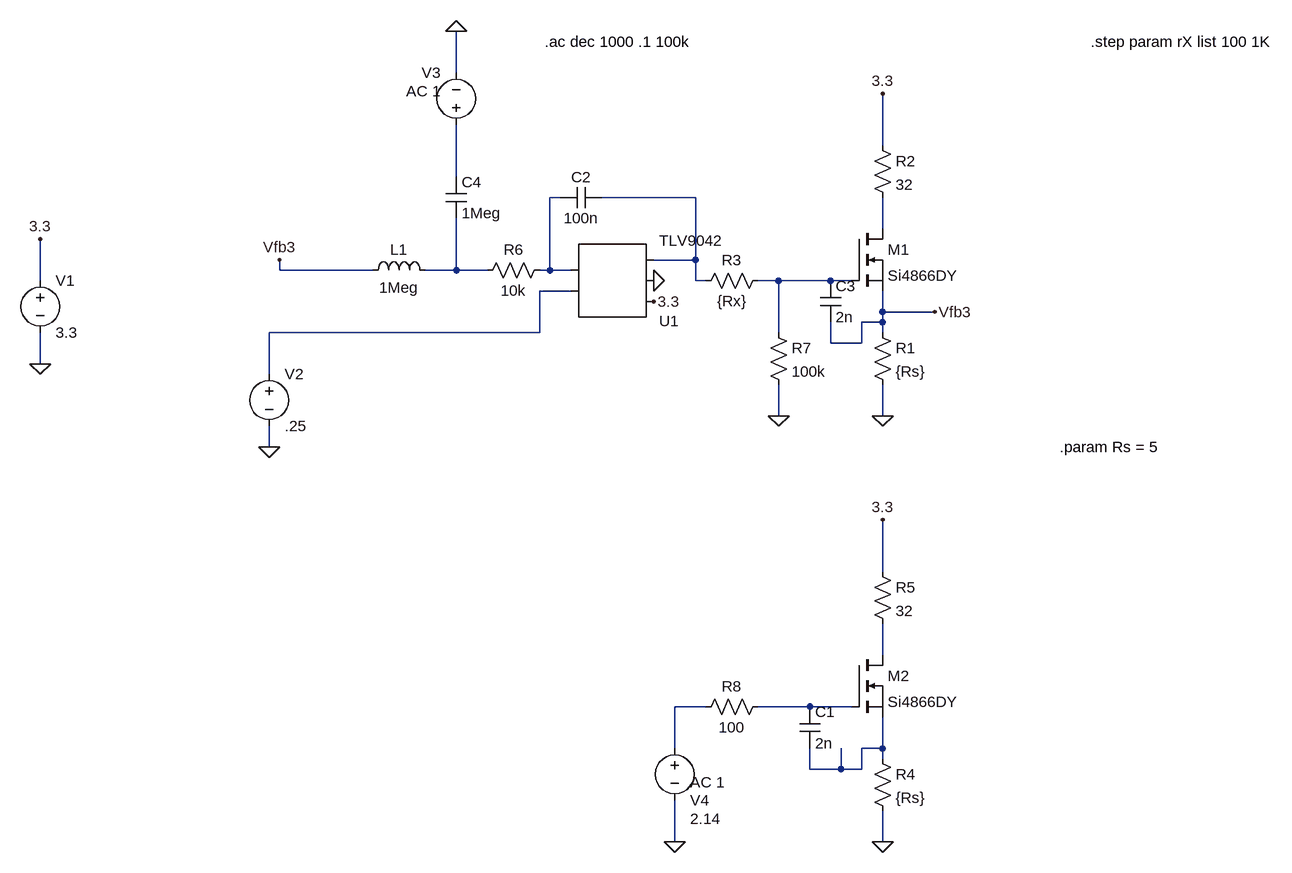
[diagram p0: schematic Test_Bed_AC.asc]
Test_Bed_AC.asc, the LTspice schematic file:
Version 4
SHEET 1 1232 1300
WIRE -48 -128 -48 -192
WIRE 608 -16 608 -96
WIRE -48 32 -48 -48
WIRE 112 64 96 64
WIRE 320 64 176 64
WIRE 608 112 608 64
WIRE 320 160 320 64
WIRE 320 160 256 160
WIRE -320 176 -320 160
WIRE -176 176 -320 176
WIRE -48 176 -48 96
WIRE -48 176 -96 176
WIRE 0 176 -48 176
WIRE 96 176 96 64
WIRE 96 176 80 176
WIRE 128 176 96 176
WIRE -688 192 -688 128
WIRE 320 192 320 160
WIRE 336 192 320 192
WIRE 448 192 416 192
WIRE 528 192 448 192
WIRE 560 192 528 192
WIRE 128 208 80 208
WIRE 608 240 608 208
WIRE 688 240 608 240
WIRE 608 256 608 240
WIRE 608 256 576 256
WIRE 80 272 80 208
WIRE 80 272 -336 272
WIRE 448 272 448 192
WIRE 608 272 608 256
WIRE 528 288 528 256
WIRE 576 288 576 256
WIRE 576 288 528 288
WIRE -688 320 -688 272
WIRE -336 336 -336 272
WIRE 448 400 448 352
WIRE 608 400 608 352
WIRE -336 448 -336 416
WIRE 608 640 608 560
WIRE 608 768 608 720
WIRE 336 848 288 848
WIRE 496 848 416 848
WIRE 560 848 496 848
WIRE 288 912 288 848
WIRE 608 912 608 864
WIRE 608 912 576 912
WIRE 608 928 608 912
WIRE 496 944 496 912
WIRE 544 944 544 912
WIRE 544 944 496 944
WIRE 576 944 576 912
WIRE 576 944 544 944
WIRE 288 1056 288 992
WIRE 608 1056 608 1008
FLAG 608 400 0
FLAG 256 224 3.3
FLAG 256 192 0
FLAG 688 240 Vfb3
FLAG -320 160 Vfb3
FLAG 608 -96 3.3
FLAG 448 400 0
FLAG -688 320 0
FLAG -688 128 3.3
FLAG -336 448 0
FLAG -48 -192 0
FLAG 608 1056 0
FLAG 608 560 3.3
FLAG 288 1056 0
SYMBOL res 592 256 R0
SYMATTR InstName R1
SYMATTR Value {Rs}
SYMBOL res 592 -32 R0
SYMATTR InstName R2
SYMATTR Value 32
SYMBOL res 432 176 R90
WINDOW 0 0 56 VBottom 2
WINDOW 3 32 56 VTop 2
SYMATTR InstName R3
SYMATTR Value {Rx}
SYMBOL nmos 560 112 R0
SYMATTR InstName M1
SYMATTR Value Si4866DY
SYMBOL res 96 160 R90
WINDOW 0 0 56 VBottom 2
WINDOW 3 32 56 VTop 2
SYMATTR InstName R6
SYMATTR Value 10k
SYMBOL cap 176 48 R90
WINDOW 0 0 32 VBottom 2
WINDOW 3 32 32 VTop 2
SYMATTR InstName C2
SYMATTR Value 100n
SYMBOL res 432 256 R0
SYMATTR InstName R7
SYMATTR Value 100k
SYMBOL AutoGenerated\\TLV9042 192 192 M180
SYMATTR InstName U1
SYMBOL cap 512 192 R0
SYMATTR InstName C3
SYMATTR Value 2n
SYMBOL voltage -688 176 R0
WINDOW 123 0 0 Left 0
WINDOW 39 0 0 Left 0
SYMATTR InstName V1
SYMATTR Value 3.3
SYMBOL voltage -336 320 R0
WINDOW 123 0 0 Left 0
WINDOW 39 0 0 Left 0
SYMATTR InstName V2
SYMATTR Value .25
SYMBOL ind -192 192 R270
WINDOW 0 32 56 VTop 2
WINDOW 3 5 56 VBottom 2
SYMATTR InstName L1
SYMATTR Value 1Meg
SYMBOL cap -64 32 R0
SYMATTR InstName C4
SYMATTR Value 1Meg
SYMBOL voltage -48 -32 R180
WINDOW 0 24 96 Left 2
WINDOW 3 24 16 Left 2
WINDOW 123 24 68 Left 2
WINDOW 39 0 0 Left 0
SYMATTR InstName V3
SYMATTR Value ""
SYMATTR Value2 AC 1
SYMBOL res 592 912 R0
SYMATTR InstName R4
SYMATTR Value {Rs}
SYMBOL res 592 624 R0
SYMATTR InstName R5
SYMATTR Value 32
SYMBOL nmos 560 768 R0
SYMATTR InstName M2
SYMATTR Value Si4866DY
SYMBOL voltage 288 896 R0
WINDOW 0 24 96 Left 2
WINDOW 3 24 124 Left 2
WINDOW 123 24 68 Left 2
WINDOW 39 0 0 Left 0
SYMATTR InstName V4
SYMATTR Value 2.14
SYMATTR Value2 AC 1
SYMBOL cap 480 848 R0
SYMATTR InstName C1
SYMATTR Value 2n
SYMBOL res 432 832 R90
WINDOW 0 0 56 VBottom 2
WINDOW 3 32 56 VTop 2
SYMATTR InstName R8
SYMATTR Value 100
TEXT 88 -176 Left 2 !.ac dec 1000 .1 100k
TEXT 880 448 Left 2 !.param Rs = 5
TEXT 928 -176 Left 2 !.step param rX list 100 1K

The netlist it stands for:
* Test_Bed_AC.asc
R1 Vfb3 0 {Rs}
R2 3.3 N004 32
R3 N006 N003 {Rx}
M1 N004 N006 Vfb3 Vfb3 Si4866DY
R6 N002 N005 10k
C2 N003 N002 100n
R7 N006 0 100k
* U1: TLV9042 (symbol AutoGenerated\TLV9042 not available, pins judged from their places): pin1=N007 pin2=N002 pin3=3.3 pin4=0 pin5=N003
C3 N006 Vfb3 2n
V1 3.3 0 3.3
V2 N007 0 .25
L1 Vfb3 N005 1Meg
C4 N001 N005 1Meg
V3 N001 0 AC 1
R4 N011 0 {Rs}
R5 3.3 N008 32
M2 N008 N010 N011 N011 Si4866DY
V4 N009 0 2.14 AC 1
C1 N010 N011 2n
R8 N010 N009 100
.model NMOS NMOS
.model PMOS PMOS
.lib standard.mos
.ac dec 1000 .1 100k
.param Rs = 5
.step param rX list 100 1K
.backanno
.end